# EAGLE design pwm (EAGLE 7.5.0)
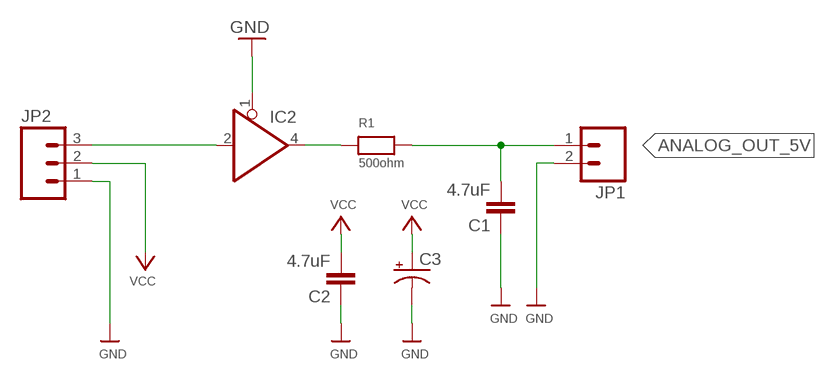
[diagram p0: schematic, sheet 1]

## Parts
C1  4.7uF  CAP1206  [1206]
C2  4.7uF  CAP1206  [1206]
C3  CPOL-USE  [PANASONIC_E]
IC2  74AHCT1G125DBV  [SOT23-5]
JP1  M02LOCK_LONGPADS  [1X02_LOCK_LONGPADS]
JP2  M03LONGPADS  [1X03_LONGPADS]
R1  500ohm  RESISTOR1206  [1206]

## Nets
ANALOG_OUT_5V: C1.2 JP1.1 R1.2
GND: C1.1 C2.1 C3.- IC2.1(OE) JP1.2 JP2.1
N$1: IC2.4(O) R1.1
PWM_IN_3V: IC2.2(I) JP2.3
VCC: C2.2 C3.+ JP2.2

## Power pins joined to a net without a drawn wire
GND: IC2.3(GND)
VCC: IC2.5(VCC)

## Library data of the parts
C1 C2 = SparkFun-Capacitors:CAP: Capacitor Standard 0603 ceramic capacitor, and 0.1" leaded capacitor.
C3 = rcl:CPOL-US: POLARIZED CAPACITOR, American symbol
IC2 = 74xx-little-de:74*1G125: Single Bus Buffer Gate with 3-State Output; DIGIKEY-ND: M74VHC1GT125DF1GOSCT-ND; MOUSER: 863-M74VHC1GT125DF2G; PARTNO: M74VHC1GT125DF2G
JP1 = SparkFun:M02: Header 2 Standard 2-pin 0.1" header. Use with straight break away headers (SKU : PRT-00116), right angle break away headers (PRT-00553), swiss pins (PRT-00743), machine pins (PRT-00117), and female headers (PRT-00115). Molex polarized connector foot print use with SKU : PRT-08233 with associated crimp pins and housings.
JP2 = SparkFun-Connectors:M03: Header 3 Standard 3-pin 0.1" header. Use with straight break away headers (SKU : PRT-00116), right angle break away headers (PRT-00553), swiss pins (PRT-00743), machine pins (PRT-00117), and female headers (PRT-00115). Molex polarized connector foot print use with SKU : PRT-08232 with associated crimp pins and housings.
R1 = microbuilder:RESISTOR: Resistors 0402 - 0402 Surface Mount Package 10.0K 1% 1/16W [Digikey: 311-10.0KLRTR-ND] 0603 - 0603 Surface Mount Package 0 Ohm 1/10 Watt 1% Resistor 15 Ohm 1/10 Watt 1% Resistor 33 Ohm 1/10 Watt 1% Resistor 49.9 Ohm 1/10 Watt 1% Resistor 100 Ohm 1/10 Watt 1% Resistor 150 Ohm 1/10 Watt 1% Resistor 240 Ohm 1/10 Watt 1% Resistor 390 Ohm 1/10 Watt 1% Resistor 560 Ohm 1/10 Watt 1% Resistor 750 Ohm 1/10 Watt 1% Resistor 1.0K Ohm 1/10 Watt 1% Resistor 1.5K Ohm 1/10 Watt 1% Resistor 2.0K Ohm 1/10 Watt 1% Resistor 4.7K Ohm 1/10 Watt 1% Resistor 10.0K Ohm 1/10 Watt 1% Resistor 20.0K Ohm 1/10 Watt 1% Resistor 33.0K Ohm 1/10 Watt 1% Resistor 100.0K Ohm 1/10 Watt 1% Resistor 0805 - 0805 Surface Mount Package 0 Ohm 1/8 Watt 1% Resistor 33 Ohm 1/8 Watt 1% Resistor 100 Ohm 1/8 Watt 1% Resistor 150 Ohm 1/8 Watt 1% Resistor 200 Ohm 1/8 Watt 1% Resistor 240 Ohm 1/8 Watt 1% Resistor 330 Ohm 1/8 Watt 1% Resistor 390 Ohm 1/8 Watt 1% Resistor 470 Ohm 1/8 Watt 1% Resistor 1.0K Ohm 1/8 Watt 1% Resistor 1.5K Ohm 1/8 Watt 1% Resistor 2.0K Ohm 1/8 Watt 1% Resistor 4.7K Ohm 1/8 Watt 1% Resistor 5.1K Ohm 1/8 Watt 1% Resistor 5.6K Ohm 1/8 Watt 1% Resistor 10.0K Ohm 1/8 Watt 1% Resistor 22.0K Ohm 1/8 Watt 1% Resistor 33.0K Ohm 1/8 Watt 1% Resistor 100K Ohm 1/8 Watt 1% Resistor 1206 - 1206 Surface Mount Package

## Net classes
0 default: width 0.203 mm

## Board
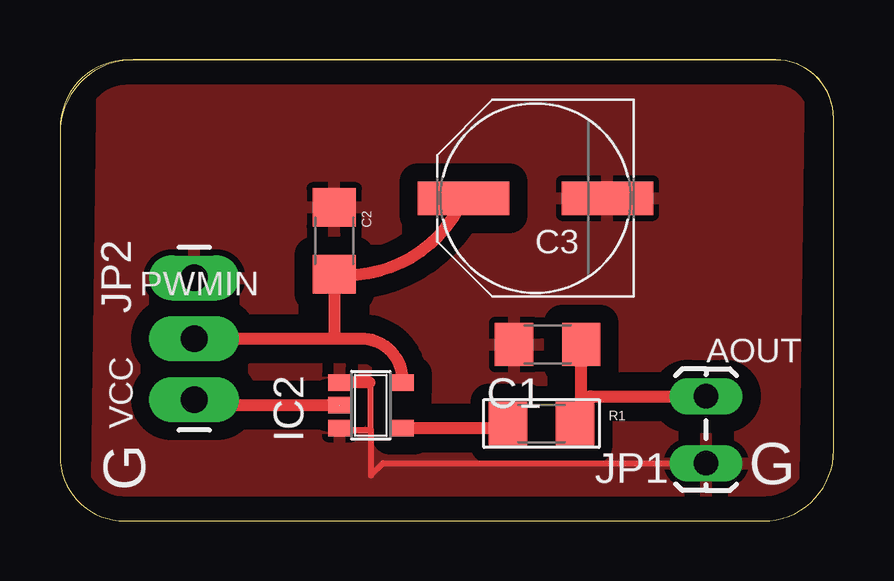
[diagram p1: board, top side]

Size 32.24 x 19.23 mm. Coordinates in mm from the lower left corner, seen from the top.
Outline: 32.24,2.94 32.24,16.78 arc90 29.79,19.23 2.85,19.23 arc90 0,16.38 0,2.7 arc90 2.7,0 29.29,0 arc90 32.24,2.94
Copper layers (1*16): Top 0.035mm / dielectric 1.5mm / Bottom 0.035mm
Design rules "default": minimum track width 10mil, minimum drill 24mil, track to track 8mil, track to pad 8mil, pad to pad 8mil, via to via 8mil, smd to smd 8mil, copper to edge 40mil, drill to drill 8mil, minimum pad ring 10mil, minimum via ring 8mil, stop-mask expansion 4mil, vias tented up to drill 0mil, thermal gap 10mil
Milling: 8 lines

### Footprints (pad centres in the part's own frame; a part is rotated, then mirrored left to right if it is on the bottom)
1206 = smd 1.6 x 1.8: 1 -1.4,0; 2 1.4,0
PANASONIC_E = smd 3.8 x 1.4: + 3,0; - -3,0
SOT23-5 = smd 0.69 x 0.99: 1 -0.95,-1.29; 2 0,-1.29; 3 0.95,-1.29; 4 0.95,1.3; 5 -0.95,1.3
1X02_LOCK_LONGPADS = drill 1.016 long: 1 -0.127,0; 2 2.667,0
1X03_LONGPADS = drill 1.118 pad 1.88 long: 1 0,0; 2 2.54,0; 3 5.08,0

### Placement (x,y rotation side)
C1  20.32,7.37 0 top
C2  11.43,11.68 270 top
C3  19.81,13.46 180 top
IC2  12.95,4.83 270 top
JP1  26.92,5.08 270 top
JP2  5.59,10.14 270 top
R1  20.07,4.06 0 top

### Tracks (layer width: path | path; a pad name or v marks a point on that pad's centre or on a via)
ANALOG_OUT_5V
  Top 0.254: R1.2 21.72,4.32
  Top 0.508: R1.2 22.1,5.21 JP1.1 | 21.72,4.32 C1.2
GND
  Top 0.254: IC2.3 11.73,3.81 12.95,3.81 | 12.95,3.81 12.95,5.84 12.89,5.78 | 12.95,3.81 12.95,1.9 13.46,2.41 JP1.2
  Top 0.508: 12.89,5.78 IC2.1
  pour Top (isolate 0.762): 30.52,0.19 1.52,0.19 1.78,18.49 30.78,18.49
N$1
  Top 0.254: 18.48,3.88 arc90 R1.1
  Top 0.508: IC2.4 18.48,3.88
PWM_IN_3V
  Top 0.254: 5.83,4.83 JP2.3
  Top 0.508: IC2.2 5.83,4.83
VCC
  Top 0.254: C2.2 arc90 11.41,10.26
  Top 0.508: JP2.2 11.43,7.6 | 11.43,7.6 12.68,7.6 arc-90 IC2.5 | C3.+ arc-72 C2.2 11.43,7.6

### Text on the board
tNames: PWMIN | VCC | AOUT | G | G